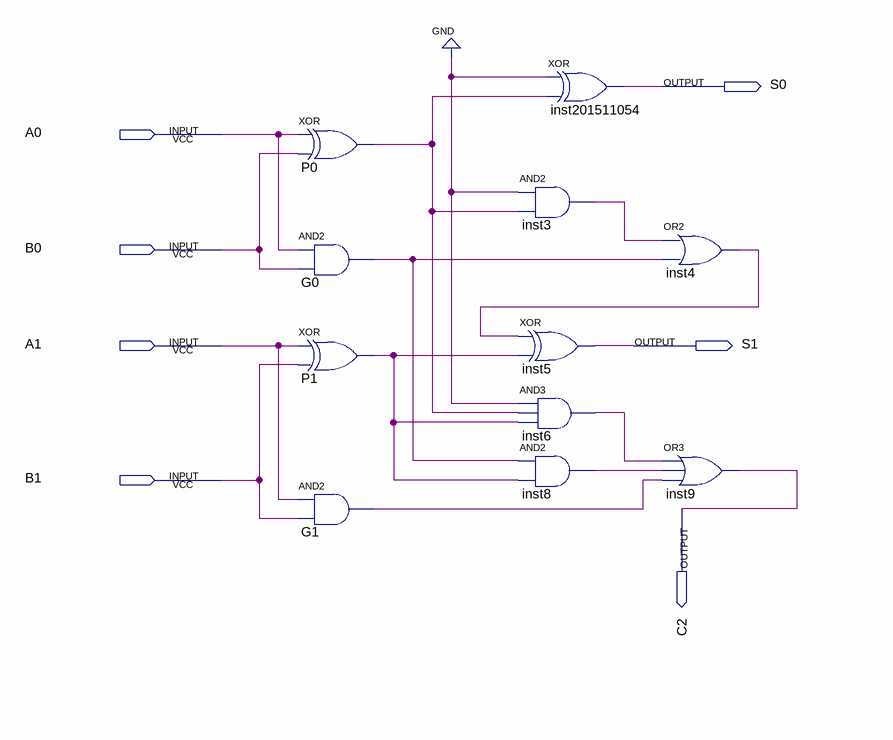
[diagram p0: schematic sheet]
// Quartus schematic lab03_2.bdf as structural Verilog: 11 symbols, 7 pins
module lab03_2 (
  input  A0,
  input  B0,
  input  A1,
  input  B1,
  output S0,
  output S1,
  output C2
);

  wire G0_out, G1_out, inst3_out, inst4_out, inst6_out, inst8_out, P0_out, P1_out;

  xor P0 (P0_out, A0, B0);
  and G0 (G0_out, A0, B0);
  xor P1 (P1_out, A1, B1);
  and G1 (G1_out, A1, B1);
  and inst3 (inst3_out, 1'b0, P0_out);
  xor inst5 (S1, inst4_out, P1_out);
  and inst6 (inst6_out, 1'b0, P0_out, P1_out);
  and inst8 (inst8_out, G0_out, P1_out);
  xor inst201511054 (S0, 1'b0, P0_out);
  or inst4 (inst4_out, inst3_out, G0_out);
  or inst9 (C2, inst6_out, inst8_out, G1_out);
endmodule
